# Altium schematic sheet Serial_Registers.SchDoc: Serial Registers
size 420 x 297 mm; Organization: Altium Limited; Address1: L3, 12a Rodborough Rd; Address2: Frenchs Forest; Address3: NSW; Address4: Australia 2086; SheetNumber: 6; SheetTotal: 8
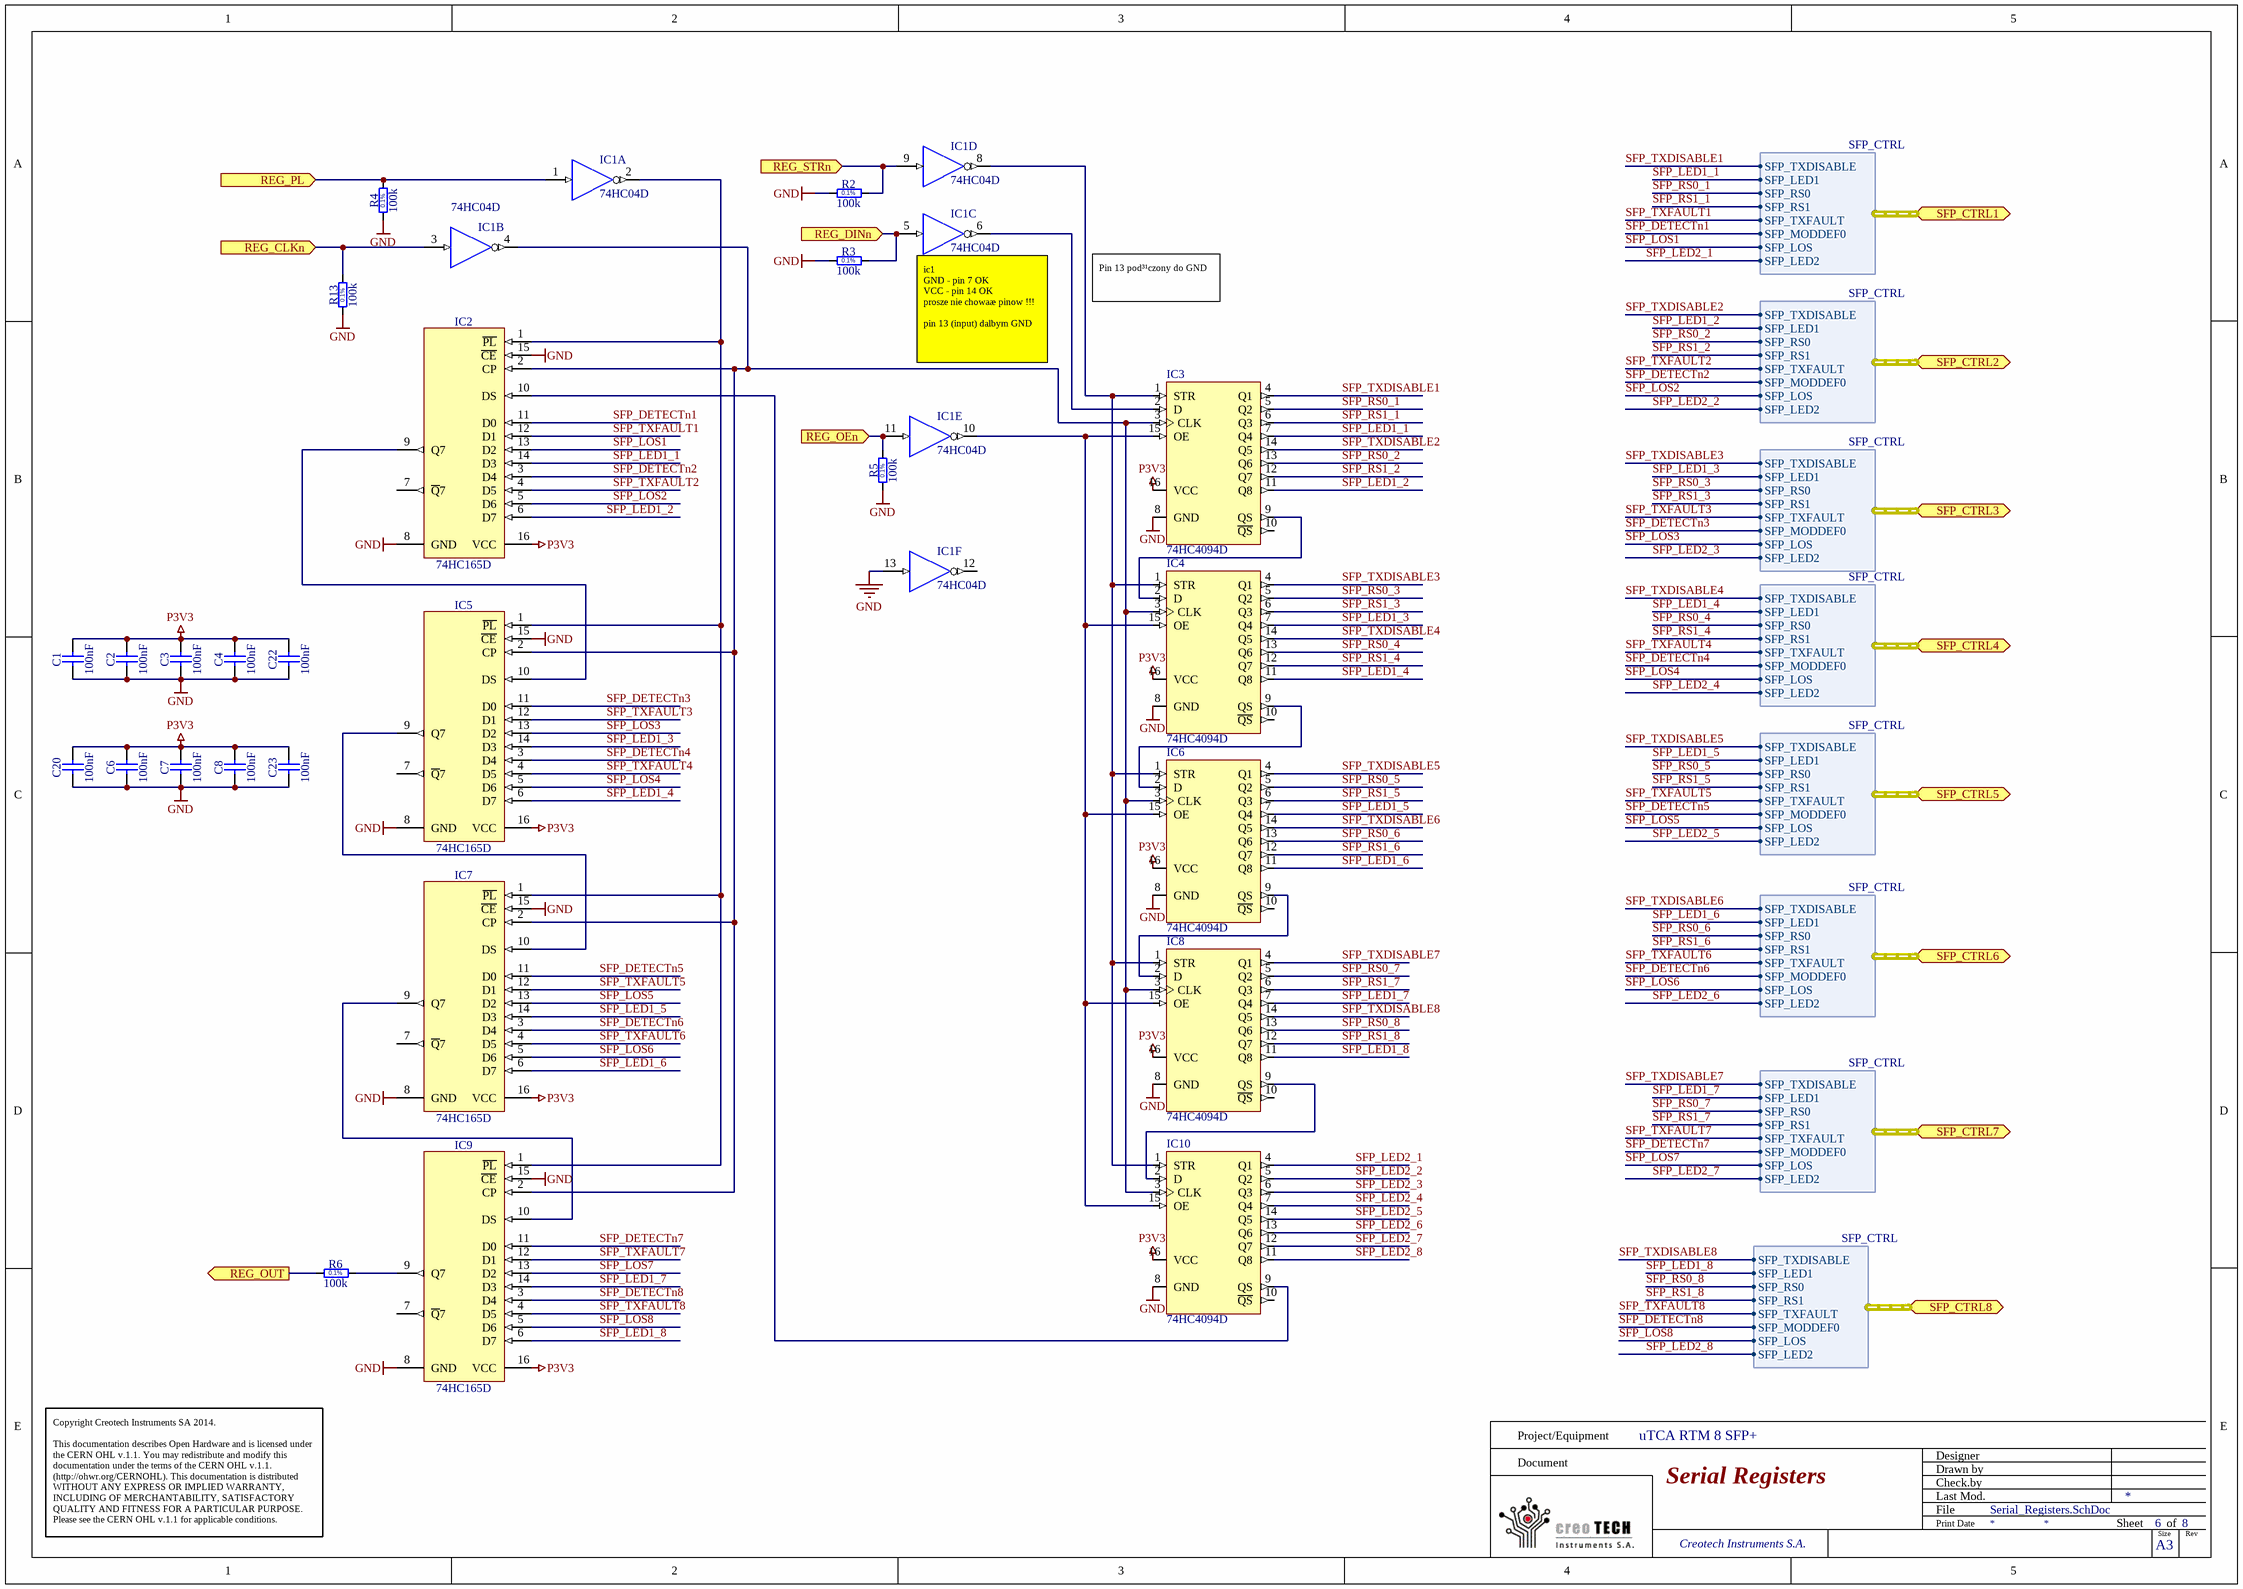
[diagram p0: Serial_Registers.SchDoc]

## Parts
C1  100nF  [CAPC1005X55N]
C2  100nF  [CAPC1005X55N]
C3  100nF  [CAPC1005X55N]
C4  100nF  [CAPC1005X55N]
C6  100nF  [CAPC1005X55N]
C7  100nF  [CAPC1005X55N]
C8  100nF  [CAPC1005X55N]
C20  100nF  [CAPC1005X55N]
C22  100nF  [CAPC1005X55N]
C23  100nF  [CAPC1005X55N]
IC1  74HC04D  [SOIC127P600X175-14N]  (parts A,B,C,D,E,F of 6)
IC2  74HC165D  [SOIC127P600X175-16N]
IC3  74HC4094D  [SO-16]
IC4  74HC4094D  [SO-16]
IC5  74HC165D  [SOIC127P600X175-16N]
IC6  74HC4094D  [SO-16]
IC7  74HC165D  [SOIC127P600X175-16N]
IC8  74HC4094D  [SO-16]
IC9  74HC165D  [SOIC127P600X175-16N]
IC10  74HC4094D  [SO-16]
R2  100k  [RESC1608X55N]
R3  100k  [RESC1608X55N]
R4  100k  [RESC1608X55N]
R5  100k  [RESC1608X55N]
R6  100k  [RESC1608X55N]
R13  100k  [RESC1608X55N]

## Ports
REG_CLKn (in), REG_DINn (in), REG_OEn (in), REG_OUT (out), REG_PL (in), REG_STRn (in), SFP_CTRL1 (harness SFP_CTRL), SFP_CTRL2 (harness SFP_CTRL), SFP_CTRL3 (harness SFP_CTRL), SFP_CTRL4 (harness SFP_CTRL), SFP_CTRL5 (harness SFP_CTRL), SFP_CTRL6 (harness SFP_CTRL), SFP_CTRL7 (harness SFP_CTRL), SFP_CTRL8 (harness SFP_CTRL)

## Harnesses
SFP_CTRL: SFP_LED1, SFP_TXFAULT, SFP_TXDISABLE, SFP_MODDEF0, SFP_RS0, SFP_RS1, SFP_LOS, SFP_LED2

## Nets
GND: C1.2 C2.2 C3.2 C4.2 C6.2 C7.2 C8.2 C20.2 C22.2 C23.2 IC1.7(GND) IC1.13(A) IC2.8(GND) IC2.15(~{CE}) IC3.8(GND) IC4.8(GND) IC5.8(GND) IC5.15(~{CE}) IC6.8(GND) IC7.8(GND) IC7.15(~{CE}) IC8.8(GND) IC9.8(GND) IC9.15(~{CE}) IC10.8(GND) R2.1 R3.1 R4.1 R5.1 R13.1
P3V3: C1.1 C2.1 C3.1 C4.1 C6.1 C7.1 C8.1 C20.1 C22.1 C23.1 IC1.14(VCC) IC2.16(VCC) IC3.16(VCC) IC4.16(VCC) IC5.16(VCC) IC6.16(VCC) IC7.16(VCC) IC8.16(VCC) IC9.16(VCC) IC10.16(VCC)
REG_CLKn: IC1.3(A) R13.2 ; port REG_CLKn
REG_DINn: IC1.5(A) R3.2 ; port REG_DINn
REG_OEn: IC1.11(A) R5.2 ; port REG_OEn
REG_OUT: R6.1 ; port REG_OUT
REG_PL: IC1.1(A) R4.2 ; port REG_PL
REG_STRn: IC1.9(A) R2.2 ; port REG_STRn
SFP_DETECTn1: IC2.11(D0) ; port SFP_CTRL1.SFP_MODDEF0
SFP_DETECTn2: IC2.3(D4) ; port SFP_CTRL2.SFP_MODDEF0
SFP_DETECTn3: IC5.11(D0) ; port SFP_CTRL3.SFP_MODDEF0
SFP_DETECTn4: IC5.3(D4) ; port SFP_CTRL4.SFP_MODDEF0
SFP_DETECTn5: IC7.11(D0) ; port SFP_CTRL5.SFP_MODDEF0
SFP_DETECTn6: IC7.3(D4) ; port SFP_CTRL6.SFP_MODDEF0
SFP_DETECTn7: IC9.11(D0) ; port SFP_CTRL7.SFP_MODDEF0
SFP_DETECTn8: IC9.3(D4) ; port SFP_CTRL8.SFP_MODDEF0
SFP_LED1_1: IC2.14(D3) IC3.7(Q4) ; port SFP_CTRL1.SFP_LED1
SFP_LED1_2: IC2.6(D7) IC3.11(Q8) ; port SFP_CTRL2.SFP_LED1
SFP_LED1_3: IC4.7(Q4) IC5.14(D3) ; port SFP_CTRL3.SFP_LED1
SFP_LED1_4: IC4.11(Q8) IC5.6(D7) ; port SFP_CTRL4.SFP_LED1
SFP_LED1_5: IC6.7(Q4) IC7.14(D3) ; port SFP_CTRL5.SFP_LED1
SFP_LED1_6: IC6.11(Q8) IC7.6(D7) ; port SFP_CTRL6.SFP_LED1
SFP_LED1_7: IC8.7(Q4) IC9.14(D3) ; port SFP_CTRL7.SFP_LED1
SFP_LED1_8: IC8.11(Q8) IC9.6(D7) ; port SFP_CTRL8.SFP_LED1
SFP_LED2_1: IC10.4(Q1) ; port SFP_CTRL1.SFP_LED2
SFP_LED2_2: IC10.5(Q2) ; port SFP_CTRL2.SFP_LED2
SFP_LED2_3: IC10.6(Q3) ; port SFP_CTRL3.SFP_LED2
SFP_LED2_4: IC10.7(Q4) ; port SFP_CTRL4.SFP_LED2
SFP_LED2_5: IC10.14(Q5) ; port SFP_CTRL5.SFP_LED2
SFP_LED2_6: IC10.13(Q6) ; port SFP_CTRL6.SFP_LED2
SFP_LED2_7: IC10.12(Q7) ; port SFP_CTRL7.SFP_LED2
SFP_LED2_8: IC10.11(Q8) ; port SFP_CTRL8.SFP_LED2
SFP_LOS1: IC2.13(D2) ; port SFP_CTRL1.SFP_LOS
SFP_LOS2: IC2.5(D6) ; port SFP_CTRL2.SFP_LOS
SFP_LOS3: IC5.13(D2) ; port SFP_CTRL3.SFP_LOS
SFP_LOS4: IC5.5(D6) ; port SFP_CTRL4.SFP_LOS
SFP_LOS5: IC7.13(D2) ; port SFP_CTRL5.SFP_LOS
SFP_LOS6: IC7.5(D6) ; port SFP_CTRL6.SFP_LOS
SFP_LOS7: IC9.13(D2) ; port SFP_CTRL7.SFP_LOS
SFP_LOS8: IC9.5(D6) ; port SFP_CTRL8.SFP_LOS
SFP_RS0_1: IC3.5(Q2) ; port SFP_CTRL1.SFP_RS0
SFP_RS0_2: IC3.13(Q6) ; port SFP_CTRL2.SFP_RS0
SFP_RS0_3: IC4.5(Q2) ; port SFP_CTRL3.SFP_RS0
SFP_RS0_4: IC4.13(Q6) ; port SFP_CTRL4.SFP_RS0
SFP_RS0_5: IC6.5(Q2) ; port SFP_CTRL5.SFP_RS0
SFP_RS0_6: IC6.13(Q6) ; port SFP_CTRL6.SFP_RS0
SFP_RS0_7: IC8.5(Q2) ; port SFP_CTRL7.SFP_RS0
SFP_RS0_8: IC8.13(Q6) ; port SFP_CTRL8.SFP_RS0
SFP_RS1_1: IC3.6(Q3) ; port SFP_CTRL1.SFP_RS1
SFP_RS1_2: IC3.12(Q7) ; port SFP_CTRL2.SFP_RS1
SFP_RS1_3: IC4.6(Q3) ; port SFP_CTRL3.SFP_RS1
SFP_RS1_4: IC4.12(Q7) ; port SFP_CTRL4.SFP_RS1
SFP_RS1_5: IC6.6(Q3) ; port SFP_CTRL5.SFP_RS1
SFP_RS1_6: IC6.12(Q7) ; port SFP_CTRL6.SFP_RS1
SFP_RS1_7: IC8.6(Q3) ; port SFP_CTRL7.SFP_RS1
SFP_RS1_8: IC8.12(Q7) ; port SFP_CTRL8.SFP_RS1
SFP_TXDISABLE1: IC3.4(Q1) ; port SFP_CTRL1.SFP_TXDISABLE
SFP_TXDISABLE2: IC3.14(Q5) ; port SFP_CTRL2.SFP_TXDISABLE
SFP_TXDISABLE3: IC4.4(Q1) ; port SFP_CTRL3.SFP_TXDISABLE
SFP_TXDISABLE4: IC4.14(Q5) ; port SFP_CTRL4.SFP_TXDISABLE
SFP_TXDISABLE5: IC6.4(Q1) ; port SFP_CTRL5.SFP_TXDISABLE
SFP_TXDISABLE6: IC6.14(Q5) ; port SFP_CTRL6.SFP_TXDISABLE
SFP_TXDISABLE7: IC8.4(Q1) ; port SFP_CTRL7.SFP_TXDISABLE
SFP_TXDISABLE8: IC8.14(Q5) ; port SFP_CTRL8.SFP_TXDISABLE
SFP_TXFAULT1: IC2.12(D1) ; port SFP_CTRL1.SFP_TXFAULT
SFP_TXFAULT2: IC2.4(D5) ; port SFP_CTRL2.SFP_TXFAULT
SFP_TXFAULT3: IC5.12(D1) ; port SFP_CTRL3.SFP_TXFAULT
SFP_TXFAULT4: IC5.4(D5) ; port SFP_CTRL4.SFP_TXFAULT
SFP_TXFAULT5: IC7.12(D1) ; port SFP_CTRL5.SFP_TXFAULT
SFP_TXFAULT6: IC7.4(D5) ; port SFP_CTRL6.SFP_TXFAULT
SFP_TXFAULT7: IC9.12(D1) ; port SFP_CTRL7.SFP_TXFAULT
SFP_TXFAULT8: IC9.4(D5) ; port SFP_CTRL8.SFP_TXFAULT
NetIC1_2: IC1.2(~{O}) IC2.1(~{PL}) IC5.1(~{PL}) IC7.1(~{PL}) IC9.1(~{PL})
NetIC1_4: IC1.4(~{O}) IC2.2(CP) IC3.3(CLK) IC4.3(CLK) IC5.2(CP) IC6.3(CLK) IC7.2(CP) IC8.3(CLK) IC9.2(CP) IC10.3(CLK)
NetIC1_6: IC1.6(~{O}) IC3.2(D)
NetIC1_8: IC1.8(~{O}) IC3.1(STR) IC4.1(STR) IC6.1(STR) IC8.1(STR) IC10.1(STR)
NetIC1_10: IC1.10(~{O}) IC3.15(OE) IC4.15(OE) IC6.15(OE) IC8.15(OE) IC10.15(OE)
NetIC2_9: IC2.9(Q7) IC5.10(DS)
NetIC2_10: IC2.10(DS) IC10.9(QS)
NetIC3_9: IC3.9(QS) IC4.2(D)
NetIC4_9: IC4.9(QS) IC6.2(D)
NetIC5_9: IC5.9(Q7) IC7.10(DS)
NetIC6_9: IC6.9(QS) IC8.2(D)
NetIC7_9: IC7.9(Q7) IC9.10(DS)
NetIC8_9: IC8.9(QS) IC10.2(D)
NetIC9_9: IC9.9(Q7) R6.2

Not connected (* = marked no-connect by the designer): IC1 12(~{O}); IC2 7(~{Q}7); IC3 10(~{QS}); IC4 10(~{QS}); IC5 7(~{Q}7); IC6 10(~{QS}); IC7 7(~{Q}7); IC8 10(~{QS}); IC9 7(~{Q}7); IC10 10(~{QS})

## Notes on the sheet
- Pin 13 pod³¹czony do GND
- (near IC1) ic1
  GND - pin 7 OK
  VCC - pin 14 OK
  prosze nie chowaæ pinow !!!
  pin 13 (input) dalbym GND
- Project/Equipment
- Document
- uTCA RTM 8 SFP+
- Designer
- Drawn by
- Check.by
- Copyright Creotech Instruments SA 2014.
  This documentation describes Open Hardware and is licensed under the CERN OHL v.1.1. You may redistribute and modify this documentation under the terms of the CERN OHL v.1.1. (http://ohwr.org/CERNOHL). This documentation is distributed WITHOUT ANY EXPRESS OR IMPLIED WARRANTY, INCLUDING OF MERCHANTABILITY, SATISFACTORY QUALITY AND FITNESS FOR A PARTICULAR PURPOSE. Please see the CERN OHL v.1.1 for applicable conditions.
- Creotech Instruments S.A.
- File
- Last Mod.
- Print Date
- Sheet
- Size
- A3
- of
- Rev
- (in symbol R0603_100K_0.1%_0.063W_10PPM) 0.1%

## Library data of the parts
C1-C4 C6-C8 C20 C22 C23 = CC0402_100NF_16V_10%_X7R: Non-polarised capacitor; Part Description: SMD Multilayer Chip Ceramic Capacitor; Manufacturer: GENERIC; Manufacturer1 Part Number: 223878715649; Voltage: 16V; TC: X7R; Tolerance: ±10%; Table: Capacitors SMD; Part Number: CC0402_100NF_16V_10%_X7R; Component Kind: Standard; Component Type: Standard; Pin Count: 2; Value: 100nF; Status: Not Recommended; Manufacturer Part Number: CC0402_100NF_16V_10%_X7R; Case: 0402; Mounted: Yes; Socket: No; SMD: Yes; Manufacturer1 Example: PHYCOMP; Manufacturer1 ComponentHeight: 0.55mm; HelpURL: \\cern.ch\dfs\Applications\Altium\Datasheets\CC0402_X7R_PHYCOMP.pdf; Author: CERN DEM JLC; CreateDate: 12/3/2007; LatestRevisionDate: 12/3/2007
IC1 = 74HC04D: Hex Inverter; Part Description: Hex Inverters; Manufacturer: NXP SEMICONDUCTORS; Table: Standard Logic; Part Number: 74HC04D; Component Kind: Standard; Component Type: Standard; Device: 74HC04D; PackageDescription: SOIC 14, Pitch 1.27mm - Body 4x8.75mm, IPC Medium Density; Manufacturer Part Number: 74HC04D; Pin Count: 12; Case: SOIC14; Mounted: Yes; Socket: No; SMD: Yes; ComponentHeight: 1.75mm; Author: CERN DEM JLC; HelpURL: \\cern.ch\dfs\Applications\Altium\Datasheets\74HC04D.pdf; CreateDate: 2011-04-06; LatestRevisionDate: 2011-04-06
IC2 IC5 IC7 IC9 = 74HC165D: 8-Bit Parallel-In/Serial Out Shift Register; Manufacturer: NXP SEMICONDUCTORS; Table: Standard Logic; Part Number: 74HC165D; Component Kind: Standard; Component Type: Standard; Device: 74HC165D; PackageDescription: SOIC 16, Pitch 1.27mm - Body 4x10mm, IPC Medium Density; Part Description: 8-Bit Parallel-In/Serial Out Shift Register; Manufacturer Part Number: 74HC165D; Pin Count: 16; Case: SOIC16; Mounted: Yes; Socket: No; SMD: Yes; ComponentHeight: 1.75mm; Author: CERN DEM JLC; HelpURL: \\cern.ch\dfs\Applications\Altium\Datasheets\74HC165D.pdf; CreateDate: 2012-04-26; LatestRevisionDate: 2012-04-26
IC3 IC4 IC6 IC8 IC10 = 4094: shift register
R2-R6 R13 = R0603_100K_0.1%_0.063W_10PPM: Resistor - 0.1%; Part Description: Thin Film Chip Resistor; Manufacturer: GENERIC; Manufacturer1 Part Number: RN73C1J100KBTDF; Power: 0.063W; TC: ±10ppm; Part Number: R0603_100K_0.1%_0.063W_10PPM; Component Kind: Standard; Component Type: Standard; Pin Count: 2; Value: 100k; Status: Not recommended; Tolerance: ±0.1%; Manufacturer Part Number: R0603_100K_0.1%_0.063W_10PPM; Case: 0603; Mounted: Yes; Sense: No; Socket: No; SMD: Yes; Manufacturer1 Example: TYCO HOLSWORTHY; Manufacturer1 ComponentHeight: 0.5mm; HelpURL: \\cern.ch\dfs\Applications\Altium\Datasheets\R0603_Tyco_RN73.pdf; Author: CERN DEM JLC; CreateDate: 03/12/2007; LatestRevisionDate: 13/03/2008